# Altium schematic sheet Memory_SRAM.SchDoc
size B; Author: E. Sims; Organization: Let's Build Rockets Inc.; SheetNumber: 2; SheetTotal: 2
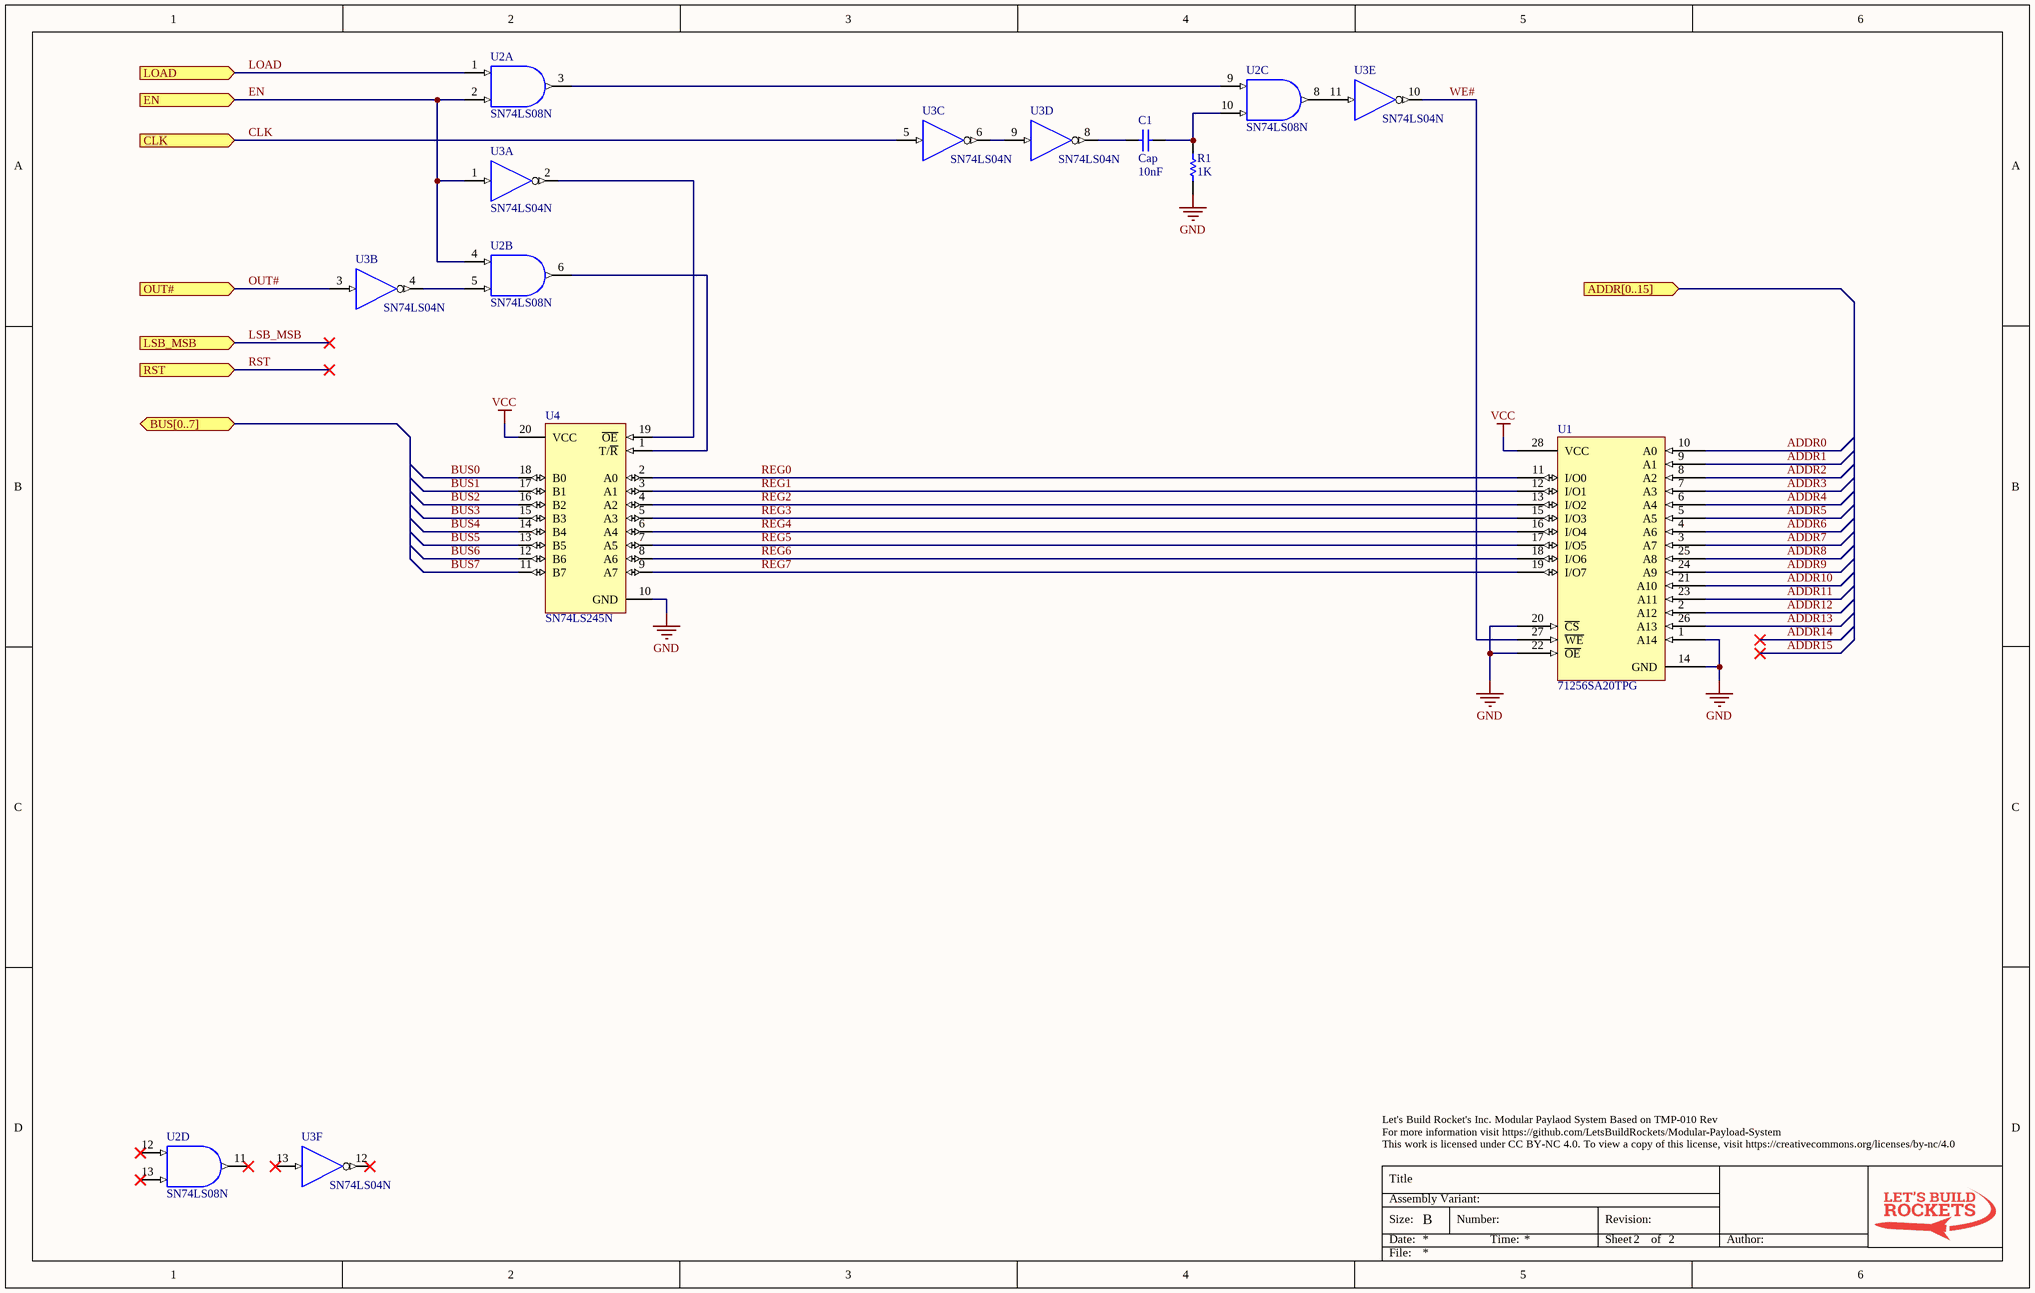
[diagram p0: Memory_SRAM.SchDoc]

## Parts
C1  Cap  value 10nF  [RAD-0.3]
R1  value 1K  [AXIAL-0.3]  (hidden comment: Res1)
U1  71256SA20TPG  [JT028]
U2  SN74LS08N  [N014]  (parts A,B,C,D of 4)
U3  SN74LS04N  [N014]  (parts A,B,C,D,E,F of 6)
U4  SN74LS245N  [N020]

## Ports
ADDR[0..15] (in), BUS[0..7] (bidir), CLK (in), EN (in), LOAD (in), LSB_MSB (in), OUT# (in), RST (in)

## Nets
GND: R1.1 U1.1(A14) U1.14(GND) U1.20(~{CS}) U1.22(~{OE}) U2.7(GND) U3.7(GND) U4.10(GND)
VCC: U1.28(VCC) U2.14(VCC) U3.14(VCC) U4.20(VCC)
ADDR0: U1.10(A0)
ADDR1: U1.9(A1)
ADDR2: U1.8(A2)
ADDR3: U1.7(A3)
ADDR4: U1.6(A4)
ADDR5: U1.5(A5)
ADDR6: U1.4(A6)
ADDR7: U1.3(A7)
ADDR8: U1.25(A8)
ADDR9: U1.24(A9)
ADDR10: U1.21(A10)
ADDR11: U1.23(A11)
ADDR12: U1.2(A12)
ADDR13: U1.26(A13)
BUS0: U4.18(B0)
BUS1: U4.17(B1)
BUS2: U4.16(B2)
BUS3: U4.15(B3)
BUS4: U4.14(B4)
BUS5: U4.13(B5)
BUS6: U4.12(B6)
BUS7: U4.11(B7)
CLK: U3.5(A) ; port CLK
EN: U2.2(B) U2.4(A) U3.1(A) ; port EN
LOAD: U2.1(A) ; port LOAD
LSB_MSB: port LSB_MSB
OUT#: U3.3(A) ; port OUT#
REG0: U1.11(I/O0) U4.2(A0)
REG1: U1.12(I/O1) U4.3(A1)
REG2: U1.13(I/O2) U4.4(A2)
REG3: U1.15(I/O3) U4.5(A3)
REG4: U1.16(I/O4) U4.6(A4)
REG5: U1.17(I/O5) U4.7(A5)
REG6: U1.18(I/O6) U4.8(A6)
REG7: U1.19(I/O7) U4.9(A7)
RST: port RST
WE#: U1.27(~{WE}) U3.10(Y)
NetC1_1: C1.1 R1.2 U2.10(B)
NetC1_2: C1.2 U3.8(Y)
NetU2_3: U2.3(Y) U2.9(A)
NetU2_5: U2.5(B) U3.4(Y)
NetU2_6: U2.6(Y) U4.1(T/~{R})
NetU2_8: U2.8(Y) U3.11(A)
NetU3_2: U3.2(Y) U4.19(~{OE})
NetU3_6: U3.6(Y) U3.9(A)

Not connected (* = marked no-connect by the designer): U2 11(Y)* 12(A)* 13(B)*; U3 12(Y)* 13(A)*

## Notes on the sheet
- Let's Build Rocket's Inc. Modular Paylaod System Based on TMP-010 Rev
  For more information visit https://github.com/LetsBuildRockets/Modular-Payload-System
  This work is licensed under CC BY-NC 4.0. To view a copy of this license, visit https://creativecommons.org/licenses/by-nc/4.0
- Title
- Size:
- Date:
- Assembly Variant:
- B
- Number:
- Time:
- Revision:
- Sheet
- of
- Author:
- File:

## Library data of the parts
C1 = Cap: Capacitor; Published: 8-Jun-2000; LatestRevisionDate: 17-Jul-2002; LatestRevisionNote: Re-released for DXP Platform.; PackageReference: RAD-0.3; Publisher: Altium Limited; PackageDescription: Radial Cap, Thru-Hole; 2 Leads; 0.3 in Pin Spacing
R1 = Res1: Resistor; Published: 8-Jun-2000; LatestRevisionDate: 17-Jul-2002; LatestRevisionNote: Re-released for DXP Platform.; PackageReference: AXIAL-0.3; Publisher: Altium Limited; PackageDescription: Axial Device, Thru-Hole; 2 Leads; 0.3 in Pin Spacing
U2 = SN74LS08N: Quadruple 2-Input Positive-AND Gate; Published: 8-Jun-2000; LatestRevisionDate: 04-Mar-2005; LatestRevisionNote: Stylized 3D Model Added.; DatasheetVersion: Mar-1988; PackageVersion: Oct-1995; PackageReference: N014; Publisher: Altium Limited; PackageDescription: DIP; 14 Leads; Row Spacing 7.62 mm; Pitch 2.54 mm; ComponentLink1Description: Manufacturer Link; ComponentLink1URL: http://www.ti.com/; ComponentLink2Description: Datasheet; ComponentLink2URL: http://www-s.ti.com/sc/ds/SN74LS08.pdf
U3 = SN74LS04N: Hex Inverter; Published: 8-Jun-2000; LatestRevisionDate: 04-Mar-2005; LatestRevisionNote: Stylized 3D Model Added.; DatasheetVersion: Mar-1988; PackageVersion: Oct-1995; PackageReference: N014; Publisher: Altium Limited; PackageDescription: DIP; 14 Leads; Row Spacing 7.62 mm; Pitch 2.54 mm; ComponentLink1Description: Manufacturer Link; ComponentLink1URL: http://www.ti.com/; ComponentLink2Description: Datasheet; ComponentLink2URL: http://www-s.ti.com/sc/ds/sn74ls04.pdf
U4 = SN74LS245N: Octal Bus Transceiver with 3-State Outputs; Published: 8-Jun-2000; LatestRevisionDate: 04-Mar-2005; LatestRevisionNote: Stylized 3D Model Added.; DatasheetVersion: Mar-1988; PackageVersion: Oct-1995; PackageReference: N020; Publisher: Altium Limited; PackageDescription: DIP; 20 Leads; Row Spacing 7.62 mm; Pitch 2.54 mm; ComponentLink1Description: Manufacturer Link; ComponentLink1URL: http://www.ti.com/; ComponentLink2Description: Datasheet; ComponentLink2URL: http://www-s.ti.com/sc/ds/sn74ls245.pdf